# Altium project smoothieboard-alt.PrjPcb (part 3 of 4)

## Sheet smoothieboard-alt-p4.SchDoc: =ProjectTitle
size B; Author: JHEDLUND; Organization: Altium Limited; Address1: L3, 12a Rodborough Rd; Address2: Frenchs Forest; Address3: NSW; Address4: Australia 2086; DocumentNumber: 5; SheetNumber: 5; SheetTotal: 6
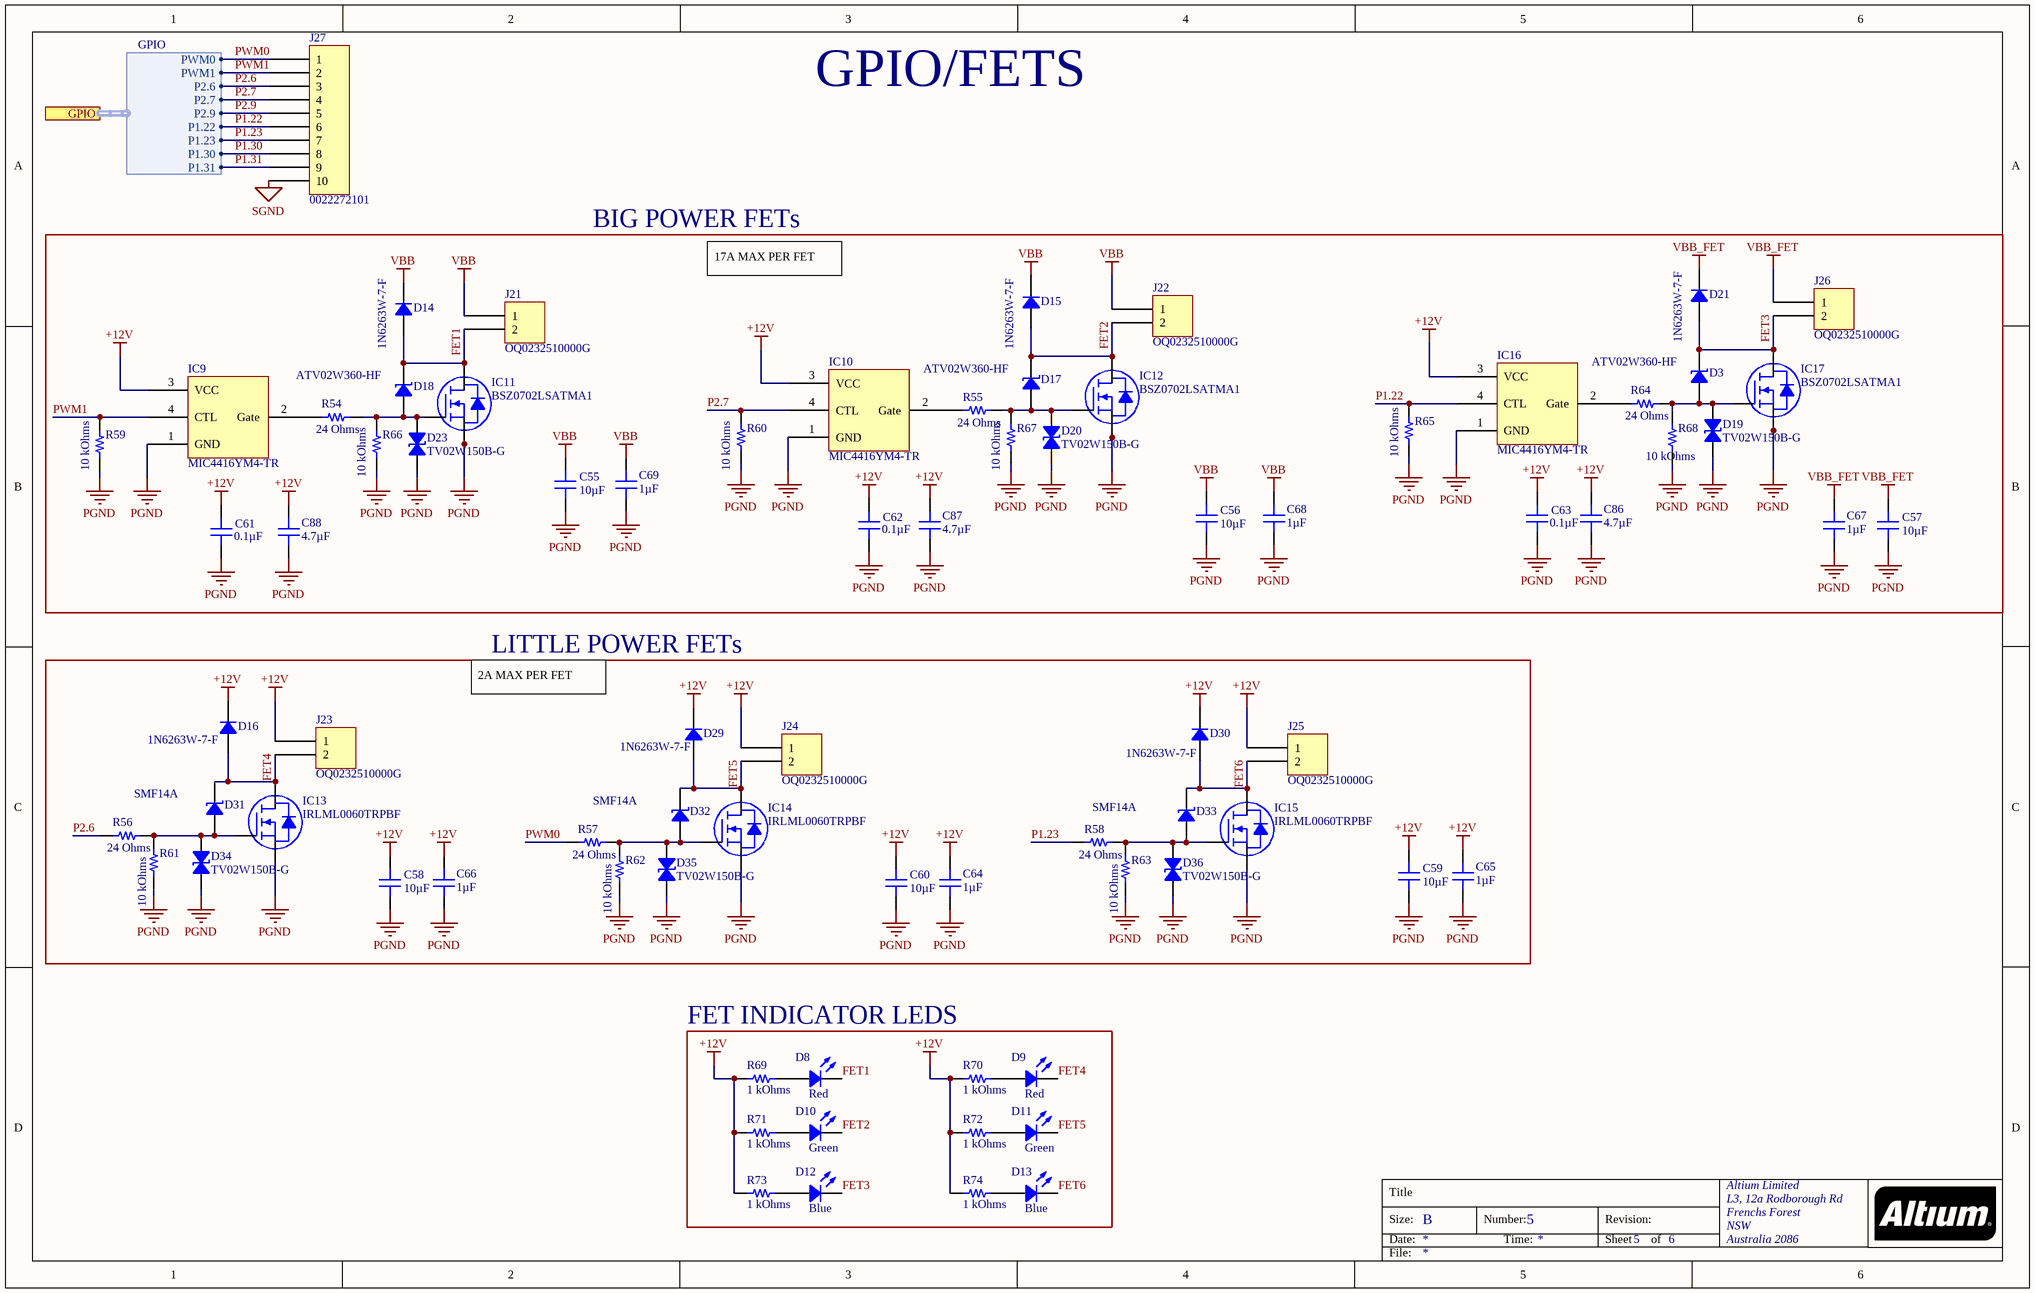
[diagram p3: smoothieboard-alt-p4.SchDoc]

### Parts
C55  10µF  [CAP 0603_1608]
C56  10µF  [CAP 0603_1608]
C57  10µF  [CAP 0603_1608]
C58  10µF  [CAP 0603_1608]
C59  10µF  [CAP 0603_1608]
C60  10µF  [CAP 0603_1608]
C61  0.1µF  [CAP 0603_1608]
C62  0.1µF  [CAP 0603_1608]
C63  0.1µF  [CAP 0603_1608]
C64  1µF  [CAP 0805_2012]
C65  1µF  [CAP 0805_2012]
C66  1µF  [CAP 0805_2012]
C67  1µF  [CAP 0805_2012]
C68  1µF  [CAP 0805_2012]
C69  1µF  [CAP 0805_2012]
C86  4.7µF  [CAP 0603_1608]
C87  4.7µF  [CAP 0603_1608]
C88  4.7µF  [CAP 0603_1608]
D3  ATV02W360-HF  [SOD123F]
D8  Red  [LED 0805_2012 RED]
D9  Red  [LED 0805_2012 RED]
D10  Green  [LED 0805_2012 GREEN]
D11  Green  [LED 0805_2012 GREEN]
D12  Blue  [LED 0805_2012 BLUE]
D13  Blue  [LED 0805_2012 BLUE]
D14  1N6263W-7-F  [SOD-123]
D15  1N6263W-7-F  [SOD-123]
D16  1N6263W-7-F  [SOD-123]
D17  ATV02W360-HF  [SOD123F]
D18  ATV02W360-HF  [SOD123F]
D19  TV02W150B-G  [SOD-123]
D20  TV02W150B-G  [SOD-123]
D21  1N6263W-7-F  [SOD-123]
D23  TV02W150B-G  [SOD-123]
D29  1N6263W-7-F  [SOD-123]
D30  1N6263W-7-F  [SOD-123]
D31  SMF14A  [SOD123F]
D32  SMF14A  [SOD123F]
D33  SMF14A  [SOD123F]
D34  TV02W150B-G  [SOD-123]
D35  TV02W150B-G  [SOD-123]
D36  TV02W150B-G  [SOD-123]
IC9  MIC4416YM4-TR  [MICROCHIP SOT-143-4]
IC10  MIC4416YM4-TR  [MICROCHIP SOT-143-4]
IC11  BSZ0702LSATMA1  [INFINEON PG-TSDSON-8]
IC12  BSZ0702LSATMA1  [INFINEON PG-TSDSON-8]
IC13  IRLML0060TRPBF  [INFINEON SOT-23-3]
IC14  IRLML0060TRPBF  [INFINEON SOT-23-3]
IC15  IRLML0060TRPBF  [INFINEON SOT-23-3]
IC16  MIC4416YM4-TR  [MICROCHIP SOT-143-4]
IC17  BSZ0702LSATMA1  [INFINEON PG-TSDSON-8]
J21  OQ0232510000G  [FCI 06-381-2PIN]
J22  OQ0232510000G  [FCI 06-381-2PIN]
J23  OQ0232510000G  [FCI 06-381-2PIN]
J24  OQ0232510000G  [FCI 06-381-2PIN]
J25  OQ0232510000G  [FCI 06-381-2PIN]
J26  OQ0232510000G  [FCI 06-381-2PIN]
J27  0022272101  [MOLEX KK 0022272101]
R54  24 Ohms  [RES 0402_1005]
R55  24 Ohms  [RES 0402_1005]
R56  24 Ohms  [RES 0402_1005]
R57  24 Ohms  [RES 0402_1005]
R58  24 Ohms  [RES 0402_1005]
R59  10 kOhms  [RES 0402_1005]
R60  10 kOhms  [RES 0402_1005]
R61  10 kOhms  [RES 0402_1005]
R62  10 kOhms  [RES 0402_1005]
R63  10 kOhms  [RES 0402_1005]
R64  24 Ohms  [RES 0402_1005]
R65  10 kOhms  [RES 0402_1005]
R66  10 kOhms  [RES 0402_1005]
R67  10 kOhms  [RES 0402_1005]
R68  10 kOhms  [RES 0402_1005]
R69  1 kOhms  [RES 0402_1005]
R70  1 kOhms  [RES 0402_1005]
R71  1 kOhms  [RES 0402_1005]
R72  1 kOhms  [RES 0402_1005]
R73  1 kOhms  [RES 0402_1005]
R74  1 kOhms  [RES 0402_1005]

### Blocks framed on the sheet
BIG POWER FETs: C55-C57 C61-C63 C67-C69 C86-C88 D3 D14 D15 D17-D21 D23 IC9-IC12 IC16 IC17 J21 J22 J26 R54 R55 R59 R60 R64-R68
LITTLE POWER FETs: C58-C60 C64-C66 D16 D29-D36 IC13-IC15 J23-J25 R56-R58 R61-R63
FET INDICATOR LEDS: D8-D13 R69-R74

### Ports
GPIO (harness GPIO)

### Harnesses
GPIO: PWM0, PWM1, P2.6, P2.7, P2.9, P1.22, P1.23, P1.30, P1.31

### Nets
+12V: C58.2 C59.2 C60.2 C61.2 C62.2 C63.2 C64.2 C65.2 C66.2 C86.2 C87.2 C88.2 D16.2 D29.2 D30.2 IC9.3(VCC) IC10.3(VCC) IC16.3(VCC) J23.1 J24.1 J25.1 R69.1 R70.1 R71.1 R72.1 R73.1 R74.1
PGND: C55.1 C56.1 C57.1 C58.1 C59.1 C60.1 C61.1 C62.1 C63.1 C64.1 C65.1 C66.1 C67.1 C68.1 C69.1 C86.1 C87.1 C88.1 D19.1 D20.1 D23.1 D34.1 D35.1 D36.1 IC9.1(GND) IC10.1(GND) IC11.1(S) IC11.2(S) IC11.3(S) IC12.1(S) IC12.2(S) IC12.3(S) IC13.2(S) IC14.2(S) IC15.2(S) IC16.1(GND) IC17.1(S) IC17.2(S) IC17.3(S) R59.1 R60.1 R61.1 R62.1 R63.1 R65.1 R66.1 R67.1 R68.1
SGND: J27.10
VBB: C55.2 C56.2 C68.2 C69.2 D14.2 D15.2 J21.1 J22.1
VBB_FET: C57.2 C67.2 D21.2 J26.1
FET1: D8.2 D14.1 D18.2 IC11.5(D) IC11.6(D) IC11.7(D) IC11.8(D) J21.2
FET2: D10.2 D15.1 D17.2 IC12.5(D) IC12.6(D) IC12.7(D) IC12.8(D) J22.2
FET3: D3.2 D12.2 D21.1 IC17.5(D) IC17.6(D) IC17.7(D) IC17.8(D) J26.2
FET4: D9.2 D16.1 D31.2 IC13.3(D) J23.2
FET5: D11.2 D29.1 D32.2 IC14.3(D) J24.2
FET6: D13.2 D30.1 D33.2 IC15.3(D) J25.2
P1.22: IC16.4(CTL) J27.6 R65.2 ; port GPIO.P1.22
P1.23: J27.7 R58.1 ; port GPIO.P1.23
P1.30: J27.8 ; port GPIO.P1.30
P1.31: J27.9 ; port GPIO.P1.31
P2.6: J27.3 R56.1 ; port GPIO.P2.6
P2.7: IC10.4(CTL) J27.4 R60.2 ; port GPIO.P2.7
P2.9: J27.5 ; port GPIO.P2.9
PWM0: J27.1 R57.1 ; port GPIO.PWM0
PWM1: IC9.4(CTL) J27.2 R59.2 ; port GPIO.PWM1
NetD3_1: D3.1 D19.2 IC17.4(G) R64.2 R68.2
NetD8_1: D8.1 R69.2
NetD9_1: D9.1 R70.2
NetD10_1: D10.1 R71.2
NetD11_1: D11.1 R72.2
NetD12_1: D12.1 R73.2
NetD13_1: D13.1 R74.2
NetD17_1: D17.1 D20.2 IC12.4(G) R55.2 R67.2
NetD18_1: D18.1 D23.2 IC11.4(G) R54.2 R66.2
NetD31_1: D31.1 D34.2 IC13.1(G) R56.2 R61.2
NetD32_1: D32.1 D35.2 IC14.1(G) R57.2 R62.2
NetD33_1: D33.1 D36.2 IC15.1(G) R58.2 R63.2
NetIC9_2: IC9.2(Gate) R54.1
NetIC10_2: IC10.2(Gate) R55.1
NetIC16_2: IC16.2(Gate) R64.1

### Notes on the sheet
- GPIO/FETS
- 17A MAX PER FET
- 2A MAX PER FET
- Title
- Size:
- Date:
- B
- Number:
- Time:
- Revision:
- Sheet
- of
- File:

### Library data of the parts
C55-C60 = GRM188R60J106KE47D: CAP CER 10UF 6.3V X5R 0603; Manufacturer: Murata Electronics; Tolerance: ±10%; Part Number: GRM188R60J106KE47D; Value: 10µF; Applications: General Purpose; Capacitance: 10µF; ComponentLink1Description: Datasheet; ComponentLink1URL: https://search.murata.co.jp/Ceramy/image/img/A01X/G101/ENG/GRM188R60J106KE47-02.pdf; ComponentLink2Description: DigiKey Link; ComponentLink2URL: http://digikey.com/product-detail/en/murata-electronics/GRM188R60J106KE47D/490-12538-1-ND/5797528; Device Package: 0603 (1608 Metric); LastUpdated: 9/2/2020 01:03:11; Lifecycle Status: Active; Minimum Order: 1; Mounting Type: Surface Mount, MLCC; Operating Temperature: -55°C ~ 85°C; Package / Case: 0603 (1608 Metric); Packaging: TapeAndReel; PartId: 14982; Part Status: Active; Price: 0.03; Series: GRM; Size / Dimension: 0.063" L x 0.031" W (1.60mm x 0.80mm); Supplier 1: DigiKey; Supplier Part Number 1: 490-12538-1-ND; Temperature Coefficient: X5R; Thickness (Max): 0.035" (0.90mm); Voltage - Rated: 6.3V
C61-C63 = CML0603X7R104KT50V: CAP CER 0.1UF 50V X7R 0603; Manufacturer: Stackpole Electronics Inc; Tolerance: ±10%; Part Number: CML0603X7R104KT50V; Value: 0.1µF; Applications: General Purpose; Capacitance: 0.1µF; ComponentLink1Description: Datasheet; ComponentLink1URL: http://www.seielect.com/Catalog/SEI-CML.PDF; ComponentLink2Description: DigiKey Link; ComponentLink2URL: http://digikey.com/product-detail/en/stackpole-electronics-inc/CML0603X7R104KT50V/738-CML0603X7R104KT50VCT-ND/10660220; Device Package: 0603 (1608 Metric); LastUpdated: 9/2/2020 01:03:28; Lifecycle Status: Active; Minimum Order: 1; Mounting Type: Surface Mount, MLCC; Operating Temperature: -55°C ~ 125°C; Package / Case: 0603 (1608 Metric); Packaging: Unknown; PartId: 26324; Part Status: Active; Price: 0.01; Series: CML_X7R; Supplier 1: DigiKey; Supplier Part Number 1: 738-CML0603X7R104KT50VCT-ND; Temperature Coefficient: X7R; Voltage - Rated: 50V
C64-C69 = 08051C105K4Z2A: CAP CER 1UF 100V X7R 0805; Manufacturer: AVX Corporation; Tolerance: ±10%; Part Number: 08051C105K4Z2A; Value: 1µF; Applications: Automotive, Boardflex Sensitive; Capacitance: 1µF; ComponentLink1Description: Datasheet; ComponentLink1URL: http://datasheets.avx.com/AutoMLCC.pdf; ComponentLink2Description: DigiKey Link; ComponentLink2URL: http://digikey.com/product-detail/en/avx-corporation/08051C105K4Z2A/478-12143-1-ND/9374712; Device Package: 0805 (2012 Metric); Features: Soft Termination; LastUpdated: 9/2/2020 01:04:22; Lifecycle Status: Active; Minimum Order: 1; Mounting Type: Surface Mount, MLCC; Operating Temperature: -55°C ~ 125°C; Package / Case: 0805 (2012 Metric); Packaging: TapeAndReel; PartId: 13513; Part Status: Active; Price: 0.10; Ratings: AEC-Q200; Series: FLEXITERM®; Size / Dimension: 0.079" L x 0.049" W (2.01mm x 1.25mm); Supplier 1: DigiKey; Supplier Part Number 1: 478-12143-1-ND; Temperature Coefficient: X7R; Voltage - Rated: 100V
C86-C88 = C1608X5R1C475K080AE: CAP CER 4.7UF 16V X5R 0603; Manufacturer: TDK Corporation; Tolerance: ±10%; Part Number: C1608X5R1C475K080AE; Value: 4.7µF; Applications: Boardflex Sensitive; Capacitance: 4.7µF; ComponentLink1Description: Datasheet; ComponentLink1URL: https://product.tdk.com/info/en/catalog/datasheets/mlcc_commercial_soft_en.pdf?ref_disty=digikey; ComponentLink2Description: DigiKey Link; ComponentLink2URL: http://digikey.com/product-detail/en/tdk-corporation/C1608X5R1C475K080AE/445-175225-1-ND/7907789; Device Package: 0603 (1608 Metric); Features: Soft Termination; LastUpdated: 9/2/2020 01:03:07; Lifecycle Status: Active; Minimum Order: 1; Mounting Type: Surface Mount, MLCC; Operating Temperature: -55°C ~ 85°C; Package / Case: 0603 (1608 Metric); Packaging: TapeAndReel; PartId: 16130; Part Status: Active; Price: 0.06; Series: C; Size / Dimension: 0.063" L x 0.031" W (1.60mm x 0.80mm); Supplier 1: DigiKey; Supplier Part Number 1: 445-175225-1-ND; Temperature Coefficient: X5R; Thickness (Max): 0.039" (1.00mm); Voltage - Rated: 16V
D3 D17 D18 = ATV02W360-HF: TVS DIODE 36V 58.1V SOD123; Manufacturer: Comchip Technology; Current - Peak Pulse (10/1000µs): 3.44A; Power Line Protection: No; Power - Peak Pulse: 200W; Type: Zener; Unidirectional Channels: 1; Voltage - Breakdown (Min): 40V; Part Number: ATV02W360-HF; Applications: Automotive; ComponentLink1Description: Datasheet; ComponentLink1URL: http://www.comchiptech.com/admin/files/product/ATV02W-HF%20series%20RevC.pdf; ComponentLink2Description: DigiKey Link; ComponentLink2URL: http://digikey.com/product-detail/en/comchip-technology/ATV02W360-HF/641-1665-1-ND/5013870; LastUpdated: 9/2/2020 01:28:36; Lifecycle Status: Active; Minimum Order: 1; Mounting Type: Surface Mount; Operating Temperature: -55°C ~ 150°C (TJ); Package / Case: SOD-123F; Packaging: TapeAndReel; PartId: 10119; Part Status: Active; Price: 0.11; Series: Automotive, AEC-Q101; Supplier 1: DigiKey; Supplier Part Number 1: 641-1665-1-ND; Supplier Device Package: SOD-123; Voltage - Clamping (Max) @ Ipp: 58.1V; Voltage - Reverse Standoff (Typ): 36V
D8 D9 = LTST-C171KRKT: LED RED CLEAR SMD; Manufacturer: Lite-On Inc.; Configuration: Standard; Current - Test: 20mA; Lens Color: Colorless; Lens Size: 1.40mm x 1.25mm; Lens Style: Rectangle with Flat Top; Millicandela Rating: 54mcd; Viewing Angle: 130°; Voltage - Forward (Vf) (Typ): 2V; Wavelength - Dominant: 631nm; Wavelength - Peak: 639nm; Part Number: LTST-C171KRKT; Color: Red; ComponentLink1Description: Datasheet; ComponentLink1URL: http://optoelectronics.liteon.com/upload/download/DS22-2000-109/LTST-C171KRKT.pdf; ComponentLink2Description: DigiKey Link; ComponentLink2URL: http://digikey.com/product-detail/en/lite-on-inc/LTST-C171KRKT/160-1427-1-ND/386800; Device Package: 0805 (2012 Metric); Height (Max): 0.90mm; LastUpdated: 9/2/2020 01:21:01; Lens Transparency: Clear; Lifecycle Status: Active; Minimum Order: 1; Mounting Type: Surface Mount; Package / Case: 0805 (2012 Metric); Packaging: TapeAndReel; PartId: 347; Part Status: Active; Price: 0.05; Series: -; Size / Dimension: 2.00mm L x 1.25mm W; Supplier 1: DigiKey; Supplier Part Number 1: 160-1427-1-ND; Value: Red
D10 D11 = LTST-C171KGKT: LED GREEN CLEAR SMD; Manufacturer: Lite-On Inc.; Configuration: Standard; Current - Test: 20mA; Lens Color: Colorless; Lens Size: 1.40mm x 1.25mm; Lens Style: Rectangle with Flat Top; Millicandela Rating: 35mcd; Viewing Angle: 130°; Voltage - Forward (Vf) (Typ): 2V; Wavelength - Dominant: 571nm; Wavelength - Peak: 574nm; Part Number: LTST-C171KGKT; Color: Green; ComponentLink1Description: Datasheet; ComponentLink1URL: http://optoelectronics.liteon.com/upload/download/DS22-2000-118/LTST-C171KGKT.pdf; ComponentLink2Description: DigiKey Link; ComponentLink2URL: http://digikey.com/product-detail/en/lite-on-inc/LTST-C171KGKT/160-1426-1-ND/386798; Device Package: 0805 (2012 Metric); Height (Max): 0.90mm; LastUpdated: 9/2/2020 01:21:04; Lens Transparency: Clear; Lifecycle Status: Active; Minimum Order: 1; Mounting Type: Surface Mount; Package / Case: 0805 (2012 Metric); Packaging: TapeAndReel; PartId: 281; Part Status: Active; Price: 0.05; Series: -; Size / Dimension: 2.00mm L x 1.25mm W; Supplier 1: DigiKey; Supplier Part Number 1: 160-1426-1-ND; Value: Green
D12 D13 = LTST-C170TBKT: LED BLUE CLEAR SMD; Manufacturer: Lite-On Inc.; Configuration: Standard; Current - Test: 20mA; Lens Color: Colorless; Lens Size: 1.40mm x 1.25mm; Lens Style: Rectangle with Flat Top; Millicandela Rating: 104mcd; Viewing Angle: 130°; Voltage - Forward (Vf) (Typ): 3.3V; Wavelength - Dominant: 470nm; Wavelength - Peak: 468nm; Part Number: LTST-C170TBKT; Color: Blue; ComponentLink1Description: Datasheet; ComponentLink1URL: http://optoelectronics.liteon.com/upload/download/DS-22-99-0226/LTST-C170TBKT.pdf; ComponentLink2Description: DigiKey Link; ComponentLink2URL: http://digikey.com/product-detail/en/lite-on-inc/LTST-C170TBKT/160-1579-1-ND/564889; Device Package: 0805 (2012 Metric); Height (Max): 1.10mm; LastUpdated: 9/2/2020 01:20:30; Lens Transparency: Clear; Lifecycle Status: Active; Minimum Order: 1; Mounting Type: Surface Mount; Package / Case: 0805 (2012 Metric); Packaging: TapeAndReel; PartId: 776; Part Status: Active; Price: 0.08; Series: -; Size / Dimension: 2.00mm L x 1.25mm W; Supplier 1: DigiKey; Supplier Part Number 1: 160-1579-1-ND; Value: Blue
D14-D16 D21 D29 D30 = 1N6263W-7-F: DIODE SCHOTTKY 60V 15MA SOD123; Manufacturer: Diodes Incorporated; Current - Average Rectified (Io): 15mA (DC); Current - Reverse Leakage @ Vr: 200nA @ 50V; Reverse Recovery Time (trr): 1ns; Speed: Small Signal =< 200mA (Io), Any Speed; Voltage - Forward (Vf) (Max) @ If: 1V @ 15mA; Part Number: 1N6263W-7-F; ComponentLink1Description: Datasheet; ComponentLink1URL: https://www.diodes.com/assets/Datasheets/ds11014.pdf; ComponentLink2Description: DigiKey Link; ComponentLink2URL: http://digikey.com/product-detail/en/diodes-incorporated/1N6263W-7-F/1N6263W-FDICT-ND/815284; Diode Type: Schottky; LastUpdated: 9/2/2020 01:19:07; Lifecycle Status: Active; Minimum Order: 1; Mounting Type: Surface Mount; Operating Temperature - Junction: -55°C ~ 125°C; Package / Case: SOD-123; Packaging: TapeAndReel; PartId: 2234; Part Status: Active; Price: 0.09; Series: -; Supplier 1: DigiKey; Supplier Part Number 1: 1N6263W-FDICT-ND; Supplier Device Package: SOD-123; Voltage - DC Reverse (Vr) (Max): 60V
D19 D20 D23 D34-D36 = TV02W150B-G: TVS DIODE 15V 24.4V SOD123; Manufacturer: Comchip Technology; Bidirectional Channels: 1; Current - Peak Pulse (10/1000µs): 8.2A; Power Line Protection: No; Power - Peak Pulse: 200W; Type: Zener; Voltage - Breakdown (Min): 16.7V; Part Number: TV02W150B-G; Applications: General Purpose; ComponentLink1Description: Datasheet; ComponentLink1URL: http://www.comchiptech.com/admin/files/product/TV02W-G series RevE.pdf; ComponentLink2Description: DigiKey Link; ComponentLink2URL: http://digikey.com/product-detail/en/comchip-technology/TV02W150B-G/641-2066-1-ND/10131652; LastUpdated: 9/2/2020 01:28:33; Lifecycle Status: Active; Minimum Order: 1; Mounting Type: Surface Mount; Operating Temperature: -55°C ~ 150°C (TJ); Package / Case: SOD-123; Packaging: TapeAndReel; PartId: 10024; Part Status: Active; Price: 0.11; Series: -; Supplier 1: DigiKey; Supplier Part Number 1: 641-2066-1-ND; Supplier Device Package: SOD-123; Voltage - Clamping (Max) @ Ipp: 24.4V; Voltage - Reverse Standoff (Typ): 15V
D31-D33 = SMF14A: TVS DIODE 14V 23.2V SOD123F; Manufacturer: Littelfuse Inc.; Current - Peak Pulse (10/1000µs): 8.6A; Power Line Protection: No; Power - Peak Pulse: 200W; Type: Zener; Unidirectional Channels: 1; Voltage - Breakdown (Min): 15.6V; Part Number: SMF14A; Applications: General Purpose; ComponentLink1Description: Datasheet; ComponentLink1URL: https://www.littelfuse.com/~/media/electronics/datasheets/tvs_diodes/littelfuse_tvs_diode_smf_datasheet.pdf.pdf; ComponentLink2Description: DigiKey Link; ComponentLink2URL: http://digikey.com/product-detail/en/littelfuse-inc/SMF14A/F5816CT-ND/3672306; LastUpdated: 9/2/2020 01:28:36; Lifecycle Status: Active; Minimum Order: 1; Mounting Type: Surface Mount; Operating Temperature: -55°C ~ 150°C (TJ); Package / Case: SOD-123F; Packaging: TapeAndReel; PartId: 10135; Part Status: Active; Price: 0.11; Series: SMF; Supplier 1: DigiKey; Supplier Part Number 1: F5816CT-ND; Supplier Device Package: SOD-123F; Voltage - Clamping (Max) @ Ipp: 23.2V; Voltage - Reverse Standoff (Typ): 14V
IC9 IC10 IC16 = MIC4416YM4-TR: IC GATE DRVR LOW-SIDE SOT143; Manufacturer: Microchip Technology; Channel Type: Single; Current - Peak Output (Source, Sink): 1.2A, 1.2A; Gate Type: N-Channel MOSFET; Input Type: Non-Inverting; Logic Voltage - VIL, VIH: 0.8V, 2.4V; Number of Drivers: 1; Rise / Fall Time (Typ): 14ns, 16ns; Voltage - Supply: 4.5V ~ 18V; Part Number: MIC4416YM4-TR; ComponentLink1Description: Datasheet; ComponentLink1URL: http://www.microchip.com/mymicrochip/filehandler.aspx?ddocname=en579163; ComponentLink2Description: DigiKey Link; ComponentLink2URL: http://digikey.com/product-detail/en/microchip-technology/MIC4416YM4-TR/576-1187-1-ND/771864; Device Package: TO-253-4, TO-253AA; Driven Configuration: Low-Side; LastUpdated: 1/31/2020 01:32:45; Lifecycle Status: Active; Minimum Order: 1; Mounting Type: Surface Mount; Operating Temperature: -40°C ~ 150°C (TJ); Package / Case: TO-253-4, TO-253AA; Packaging: TapeAndReel; PartId: 7; Part Status: Active; Price: 0.68; Series: IttyBitty®; Supplier 1: DigiKey; Supplier Part Number 1: 576-1187-1-ND; Supplier Device Package: SOT-143
IC11 IC12 IC17 = BSZ0702LSATMA1: TRENCH 40<-<100V; Manufacturer: Infineon Technologies; Current - Continuous Drain (Id) @ 25°C: 17A (Ta), 40A (Tc); Drain to Source Voltage (Vdss): 60V; Drive Voltage (Max Rds On,  Min Rds On): 4.5V, 10V; FET Type: N-Channel; Gate Charge (Qg) (Max) @ Vgs: 22nC @ 4.5V; Input Capacitance (Ciss) (Max) @ Vds: 3100pF @ 30V; Power Dissipation (Max): 2.1W (Ta), 69W (Tc); Rds On (Max) @ Id, Vgs: 4mOhm @ 20A, 10V; Vgs (Max): ±20V; Vgs(th) (Max) @ Id: 2.3V @ 36µA; Part Number: BSZ0702LSATMA1; ComponentLink1Description: Datasheet; ComponentLink1URL: https://www.infineon.com/dgdl/Infineon-BSZ0702LS-DataSheet-v02_01-EN.pdf?fileId=5546d462700c0ae601708b86789613d0; ComponentLink2Description: DigiKey Link; ComponentLink2URL: http://digikey.com/product-detail/en/infineon-technologies/BSZ0702LSATMA1/448-BSZ0702LSATMA1CT-ND/12756161; LastUpdated: 8/30/2020 21:06:51; Lifecycle Status: Active; Minimum Order: 1; Mounting Type: Surface Mount; Package / Case: 8-PowerTDFN; Packaging: TapeAndReel; Price: 0.45; Series: OptiMOS™; Supplier 1: DigiKey; Supplier Part Number 1: 448-BSZ0702LSATMA1CT-ND; Supplier Device Package: PG-TSDSON-8-FL; Technology: MOSFET (Metal Oxide); Device Package: 8-PowerTDFN
IC13-IC15 = IRLML0060TRPBF: MOSFET N-CH 60V 2.7A SOT-23-3; Manufacturer: Infineon Technologies; Current - Continuous Drain (Id) @ 25°C: 2.7A (Ta); Drive Voltage (Max Rds On,  Min Rds On): 4.5V, 10V; FET Type: N-Channel; Gate Charge (Qg) (Max) @ Vgs: 2.5nC @ 4.5V; Input Capacitance (Ciss) (Max) @ Vds: 290pF @ 25V; Power Dissipation (Max): 1.25W (Ta); Rds On (Max) @ Id, Vgs: 92mOhm @ 2.7A, 10V; Vgs (Max): ±16V; Vgs(th) (Max) @ Id: 2.5V @ 25µA; Part Number: IRLML0060TRPBF; ComponentLink1Description: Datasheet; ComponentLink1URL: https://www.infineon.com/dgdl/irlml0060pbf.pdf?fileId=5546d462533600a40153566493ef25e6; ComponentLink2Description: DigiKey Link; ComponentLink2URL: http://digikey.com/product-detail/en/infineon-technologies/IRLML0060TRPBF/IRLML0060TRPBFCT-ND/2202229; Drain to Source Voltage (Vdss): 60V; LastUpdated: 9/2/2020 01:25:05; Lifecycle Status: Active; Minimum Order: 1; Mounting Type: Surface Mount; Operating Temperature: -55°C ~ 150°C (TJ); Package / Case: TO-236-3, SC-59, SOT-23-3; Packaging: TapeAndReel; Part Status: Active; Price: 0.13; Series: HEXFET®; Supplier 1: DigiKey; Supplier Part Number 1: IRLML0060TRPBFCT-ND; Supplier Device Package: Micro3™/SOT-23; Technology: MOSFET (Metal Oxide)
J21-J26 = OQ0232510000G: TERM BLOCK HDR 2POS 90DEG 3.81MM; Manufacturer: Amphenol Anytek; Current - UL: 10A; Header Orientation: 90°, Right Angle; Number of Levels: 1; Number of Positions: 2; Pitch: 0.150" (3.81mm); Voltage - UL: 300V; Part Number: OQ0232510000G; Color: Green; ComponentLink1Description: Datasheet; ComponentLink1URL: http://portal.fciconnect.com/Comergent//fci/drawing/oqxx32x100j0g.pdf; ComponentLink2Description: DigiKey Link; ComponentLink2URL: //digikey.com/product-detail/en/amphenol-anytek/OQ0232510000G/609-3819-ND/2261255; Contact Mating Finish: Tin; LastUpdated: 12/16/2019 19:14:30; Lifecycle Status: 0; Minimum Order: 1; Mounting Type: Through Hole; Operating Temperature: -40°C ~ 115°C; Packaging: Bulk; Part Status: Active; Positions Per Level: 2; Price: 0.49; Series: 06-381; Supplier 1: DigiKey; Supplier Part Number 1: 609-3819-ND; Termination Style: Solder; Type: Header, Male Pins, Shrouded (4 Side)
J27 = 0022272101: CONN HEADER VERT 10POS 2.54MM; Manufacturer: Molex; Contact Length - Mating: 0.295" (7.49mm); Contact Length - Post: 0.140" (3.56mm); Material Flammability Rating: UL94 V-0; Number of Positions: 10; Number of Positions Loaded: All; Overall Contact Length: 0.560" (14.22mm); Pitch - Mating: 0.100" (2.54mm); Shrouding: Shrouded - 1 Wall; Style: Board to Cable/Wire; Part Number: 0022272101; ComponentLink1Description: Datasheet; ComponentLink1URL: https://www.molex.com/pdm_docs/sd/022272101_sd.pdf; ComponentLink2Description: DigiKey Link; ComponentLink2URL: http://digikey.com/product-detail/en/molex/0022272101/WM4119-ND/1130585; Connector Type: Header; Contact Finish - Mating: Tin; Contact Finish - Post: Tin; Contact Finish Thickness - Mating: 100.0µin (2.54µm); Contact Material: Brass; Contact Shape: Square; Contact Type: Male Pin; Fastening Type: Friction Lock; Insulation Color: Natural; Insulation Height: 0.461" (11.70mm); Insulation Material: Polyamide (PA), Nylon; LastUpdated: 1/12/2020 23:53:02; Lifecycle Status: Active; Minimum Order: 1; Mounting Type: Through Hole; Number of Rows: 1; Packaging: Bulk; PartId: 84; Part Status: Active; Price: 0.73; Series: KK 6410; Supplier 1: DigiKey; Supplier Part Number 1: WM4119-ND; Termination: Solder
R54-R58 R64 = ERJ-PA2F24R0X: RES SMD 24 OHM 1% 1/5W 0402; Manufacturer: Panasonic Electronic Components; Power (Watts): 0.2W, 1/5W; Temperature Coefficient: ±100ppm/°C; Part Number: ERJ-PA2F24R0X; Value: 24 Ohms; ComponentLink1Description: Datasheet; ComponentLink1URL: https://industrial.panasonic.com/cdbs/www-data/pdf/RDO0000/AOA0000C331.pdf; ComponentLink2Description: DigiKey Link; ComponentLink2URL: http://digikey.com/product-detail/en/panasonic-electronic-components/ERJ-PA2F24R0X/P124461CT-ND/10271437; Composition: Thick Film; Device Package: 0402 (1005 Metric); Features: Automotive AEC-Q200, Pulse Withstanding; Height - Seated (Max): 0.016" (0.40mm); LastUpdated: 9/2/2020 01:07:52; Lifecycle Status: Active; Minimum Order: 1; Number of Terminations: 2; Operating Temperature: -55°C ~ 155°C; Package / Case: 0402 (1005 Metric); Packaging: TapeAndReel; PartId: 11226; Part Status: Active; Price: 0.02; Ratings: AEC-Q200; Resistance: 24 Ohms; Series: ERJ; Size / Dimension: 0.039" L x 0.022" W (1.00mm x 0.55mm); Supplier 1: DigiKey; Supplier Part Number 1: P124461CT-ND; Supplier Device Package: 0402; Tolerance: ±1%
R59-R63 R65-R68 = CRCW040210K0JNTD: RES SMD 10K OHM 5% 1/16W 0402; Manufacturer: Vishay Dale; Power (Watts): 0.063W, 1/16W; Temperature Coefficient: ±200ppm/°C; Part Number: CRCW040210K0JNTD; Value: 10 kOhms; ComponentLink1Description: Datasheet; ComponentLink1URL: http://www.vishay.com/docs/20008/dcrcw.pdf; ComponentLink2Description: DigiKey Link; ComponentLink2URL: http://digikey.com/product-detail/en/vishay-dale/CRCW040210K0JNTD/541-CRCW040210K0JNTDCT-ND/11501263; Composition: Thick Film; Device Package: 0402 (1005 Metric); Features: Automotive AEC-Q200; LastUpdated: 9/2/2020 01:07:22; Lifecycle Status: Active; Minimum Order: 1; Number of Terminations: 2; Operating Temperature: -55°C ~ 155°C; Package / Case: 0402 (1005 Metric); Packaging: TapeAndReel; PartId: 56880; Price: 0.01; Ratings: AEC-Q200; Resistance: 10 kOhms; Series: CRCW; Supplier 1: DigiKey; Supplier Part Number 1: 541-CRCW040210K0JNTDCT-ND; Supplier Device Package: 0402; Tolerance: ±5%
R69-R74 = CRCW04021K00FKEDHP: RES SMD 1K OHM 1% 1/5W 0402; Manufacturer: Vishay Dale; Power (Watts): 0.2W, 1/5W; Temperature Coefficient: ±100ppm/°C; Part Number: CRCW04021K00FKEDHP; Value: 1 kOhms; ComponentLink1Description: Datasheet; ComponentLink1URL: http://www.vishay.com/docs/20043/crcwhpe3.pdf; ComponentLink2Description: DigiKey Link; ComponentLink2URL: http://digikey.com/product-detail/en/vishay-dale/CRCW04021K00FKEDHP/541-1.00KYCT-ND/2223030; Composition: Thick Film; Device Package: 0402 (1005 Metric); Features: Automotive AEC-Q200, Pulse Withstanding; Height - Seated (Max): 0.016" (0.40mm); LastUpdated: 9/2/2020 01:08:02; Lifecycle Status: Active; Minimum Order: 1; Number of Terminations: 2; Operating Temperature: -55°C ~ 155°C; Package / Case: 0402 (1005 Metric); Packaging: TapeAndReel; PartId: 6224; Part Status: Active; Price: 0.01; Ratings: AEC-Q200; Resistance: 1 kOhms; Series: CRCW-HP; Size / Dimension: 0.039" L x 0.020" W (1.00mm x 0.50mm); Supplier 1: DigiKey; Supplier Part Number 1: 541-1.00KYCT-ND; Supplier Device Package: 0402; Tolerance: ±1%

## Sheet smoothieboard-alt-p5.SchDoc: =ProjectTitle
size B; Organization: Altium Limited; Address1: L3, 12a Rodborough Rd; Address2: Frenchs Forest; Address3: NSW; Address4: Australia 2086; DocumentNumber: 6; SheetNumber: 6; SheetTotal: 6
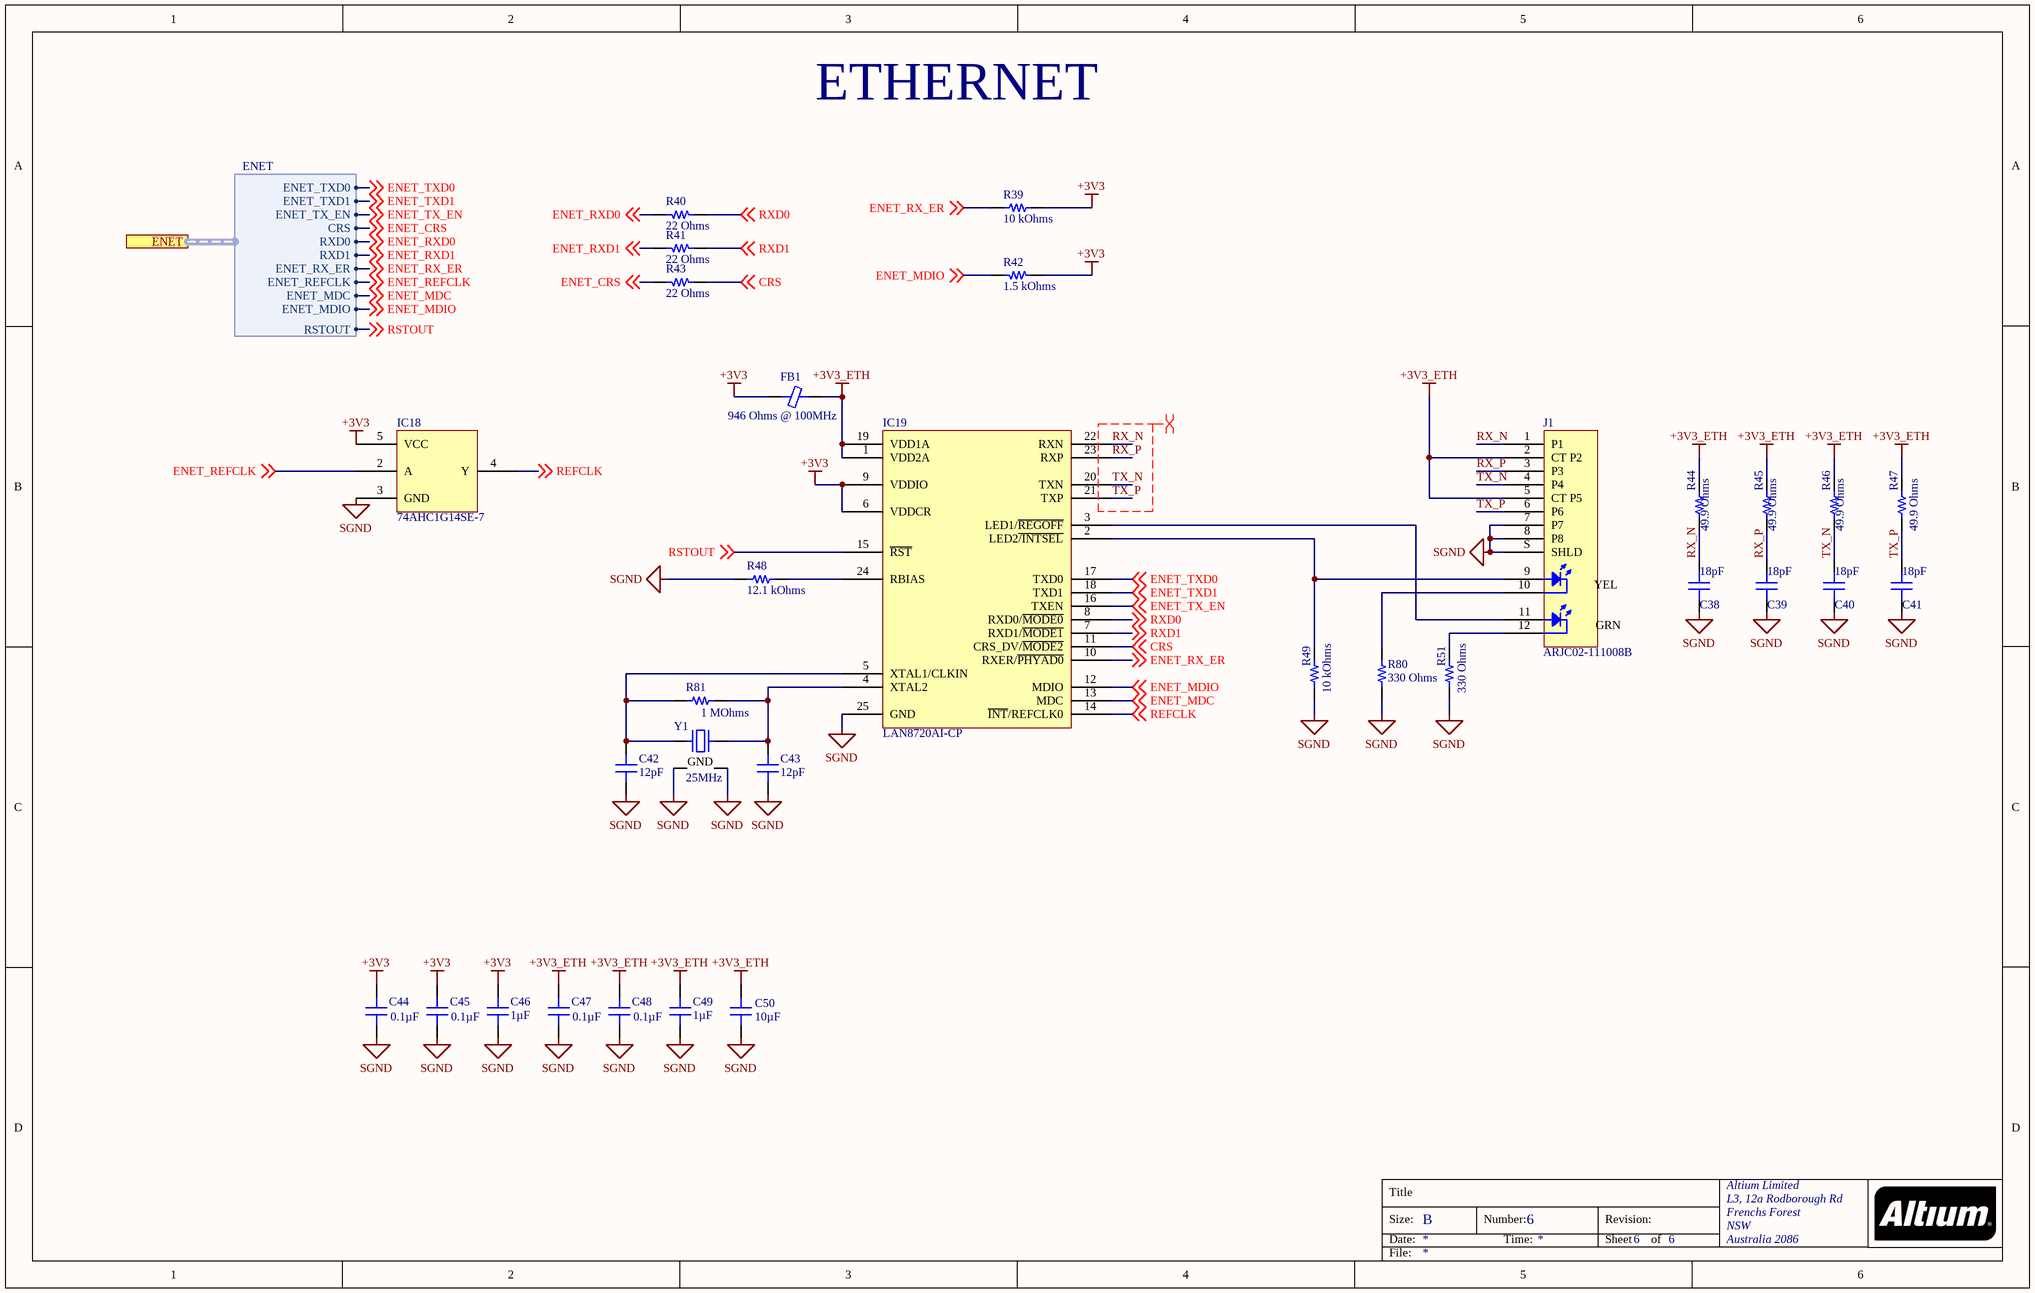
[diagram p4: smoothieboard-alt-p5.SchDoc]

### Parts
C38  18pF  [CAP 0402_1005]
C39  18pF  [CAP 0402_1005]
C40  18pF  [CAP 0402_1005]
C41  18pF  [CAP 0402_1005]
C42  12pF  [CAP 0402_1005]
C43  12pF  [CAP 0402_1005]
C44  0.1µF  [CAP 0402_1005]
C45  0.1µF  [CAP 0402_1005]
C46  1µF  [CAP 0603_1608]
C47  0.1µF  [CAP 0402_1005]
C48  0.1µF  [CAP 0402_1005]
C49  1µF  [CAP 0603_1608]
C50  10µF  [CAP 0603_1608]
FB1  946 Ohms @ 100MHz  [FER 1206_3216]
IC18  74AHC1G14SE-7  [DIODES INC - SOT353]
IC19  LAN8720AI-CP  [SMSC QFN-24 4X4MM]
J1  ARJC02-111008B  [ABRACON ARJC02-111008B]
R39  10 kOhms  [RES 0603_1608]
R40  22 Ohms  [RES 0603_1608]
R41  22 Ohms  [RES 0603_1608]
R42  1.5 kOhms  [RES 0402_1005]
R43  22 Ohms  [RES 0603_1608]
R44  49.9 Ohms  [RES 0402_1005]
R45  49.9 Ohms  [RES 0402_1005]
R46  49.9 Ohms  [RES 0402_1005]
R47  49.9 Ohms  [RES 0402_1005]
R48  12.1 kOhms  [RES 0402_1005]
R49  10 kOhms  [RES 0603_1608]
R51  330 Ohms  [RES 0603_1608]
R80  330 Ohms  [RES 0603_1608]
R81  1 MOhms  [RES 0402_1005]
Y1  25MHz  [KYOCERA CX2016DB]

### Ports
ENET (harness ENET)

### Harnesses
ENET: CRS, RXD0, RXD1, ENET_TXD0, ENET_TXD1, ENET_TX_EN, ENET_RX_ER, ENET_REFCLK, ENET_MDC, ENET_MDIO, RSTOUT

### Nets
+3V3: C44.2 C45.2 C46.2 FB1.1 IC18.5(VCC) IC19.6(VDDCR) IC19.9(VDDIO) R39.2 R42.1
+3V3_ETH: C47.2 C48.2 C49.2 C50.2 FB1.2 IC19.1(VDD2A) IC19.19(VDD1A) J1.2(CT_P2) J1.5(CT_P5) R44.2 R45.2 R46.2 R47.2
SGND: C38.1 C39.1 C40.1 C41.1 C42.2 C43.2 C44.1 C45.1 C46.1 C47.1 C48.1 C49.1 C50.1 IC18.3(GND) IC19.25(GND) J1.7(P7) J1.8(P8) J1.S(SHLD) R48.1 R49.2 R51.2 R80.2 Y1.2(GND) Y1.4(GND)
CRS: IC19.11(CRS_DV/~{MODE2}) R43.1 ; off-sheet CRS
ENET_CRS: R43.2 ; off-sheet ENET_CRS, port ENET.CRS
ENET_MDC: IC19.13(MDC) ; off-sheet ENET_MDC, port ENET.ENET_MDC
ENET_MDIO: IC19.12(MDIO) R42.2 ; off-sheet ENET_MDIO, port ENET.ENET_MDIO
ENET_REFCLK: IC18.2(A) ; off-sheet ENET_REFCLK, port ENET.ENET_REFCLK
ENET_RX_ER: IC19.10(RXER/~{PHYAD0}) R39.1 ; off-sheet ENET_RX_ER, port ENET.ENET_RX_ER
ENET_RXD0: R40.2 ; off-sheet ENET_RXD0, port ENET.RXD0
ENET_RXD1: R41.2 ; off-sheet ENET_RXD1, port ENET.RXD1
ENET_TX_EN: IC19.16(TXEN) ; off-sheet ENET_TX_EN, port ENET.ENET_TX_EN
ENET_TXD0: IC19.17(TXD0) ; off-sheet ENET_TXD0, port ENET.ENET_TXD0
ENET_TXD1: IC19.18(TXD1) ; off-sheet ENET_TXD1, port ENET.ENET_TXD1
REFCLK: IC18.4(Y) IC19.14(~{INT}/REFCLK0) ; off-sheet REFCLK
RSTOUT: IC19.15(~{RST}) ; off-sheet RSTOUT, port ENET.RSTOUT
RX_N: C38.2 IC19.22(RXN) J1.1(P1) R44.1
RX_P: C39.2 IC19.23(RXP) J1.3(P3) R45.1
RXD0: IC19.8(RXD0/~{MODE0}) R40.1 ; off-sheet RXD0
RXD1: IC19.7(RXD1/~{MODE1}) R41.1 ; off-sheet RXD1
TX_N: C40.2 IC19.20(TXN) J1.4(P4) R46.1
TX_P: C41.2 IC19.21(TXP) J1.6(P6) R47.1
NetC42_1: C42.1 IC19.5(XTAL1/CLKIN) R81.2 Y1.1
NetC43_1: C43.1 IC19.4(XTAL2) R81.1 Y1.3
NetIC19_2: IC19.2(LED2~{/INTSEL}) J1.9(P9) R49.1
NetIC19_3: IC19.3(LED1/~{REGOFF}) J1.11(P11)
NetIC19_24: IC19.24(RBIAS) R48.2
NetJ1_10: J1.10(P10) R80.1
NetJ1_12: J1.12(P12) R51.1

### Layout directives
differential pair: RX_N, RX_P, TX_N, TX_P

### Notes on the sheet
- ETHERNET
- Title
- Size:
- Date:
- B
- Number:
- Time:
- Revision:
- Sheet
- of
- File:
- (in symbol ARJC02-111008B) YEL; GRN

### Library data of the parts
C38-C41 = VJ0402A180JXJPW1BC: CAP CER 18PF 16V C0G/NP0 0402; Manufacturer: Vishay Vitramon; Temperature Coefficient: C0G, NP0; Tolerance: ±5%; Part Number: VJ0402A180JXJPW1BC; Value: 18pF; Applications: General Purpose; Capacitance: 18pF; ComponentLink1Description: Datasheet; ComponentLink1URL: https://www.vishay.com/docs/28548/vjw1bcbascomseries.pdf; ComponentLink2Description: DigiKey Link; ComponentLink2URL: http://digikey.com/product-detail/en/vishay-vitramon/VJ0402A180JXJPW1BC/720-1639-1-ND/8324059; Device Package: 0402 (1005 Metric); LastUpdated: 9/2/2020 01:02:23; Lifecycle Status: Active; Minimum Order: 1; Mounting Type: Surface Mount, MLCC; Operating Temperature: -55°C ~ 125°C; Package / Case: 0402 (1005 Metric); Packaging: TapeAndReel; PartId: 2399; Part Status: Active; Price: 0.01; Series: VJ; Size / Dimension: 0.039" L x 0.020" W (1.00mm x 0.50mm); Supplier 1: DigiKey; Supplier Part Number 1: 720-1639-1-ND; Thickness (Max): 0.022" (0.55mm); Voltage - Rated: 16V
C42 C43 = C0402C120J8GAC7867: CAP CER 12PF 10V NP0 0402; Manufacturer: KEMET; Temperature Coefficient: C0G, NP0; Tolerance: ±5%; Part Number: C0402C120J8GAC7867; Value: 12pF; Applications: General Purpose; Capacitance: 12pF; ComponentLink1Description: Datasheet; ComponentLink1URL: https://api.kemet.com/component-edge/download/datasheet/C0402C120J8GACTU.pdf; ComponentLink2Description: DigiKey Link; ComponentLink2URL: http://digikey.com/product-detail/en/kemet/C0402C120J8GAC7867/399-14417-1-ND/7103709; Device Package: 0402 (1005 Metric); Features: Low ESL; LastUpdated: 9/2/2020 01:02:11; Lifecycle Status: Active; Minimum Order: 1; Mounting Type: Surface Mount, MLCC; Operating Temperature: -55°C ~ 125°C; Package / Case: 0402 (1005 Metric); Packaging: TapeAndReel; PartId: 7556; Part Status: Active; Price: 0.07; Series: SMD Comm C0G; Size / Dimension: 0.039" L x 0.020" W (1.00mm x 0.50mm); Supplier 1: DigiKey; Supplier Part Number 1: 399-14417-1-ND; Thickness (Max): 0.022" (0.55mm); Voltage - Rated: 10V
C44 C45 C47 C48 = CC0402MRX5R5BB104: CAP CER 0.1UF 6.3V X5R 0402; Manufacturer: Yageo; Tolerance: ±20%; Part Number: CC0402MRX5R5BB104; Value: 0.1µF; Applications: General Purpose; Capacitance: 0.1µF; ComponentLink1Description: Datasheet; ComponentLink1URL: https://www.yageo.com/upload/media/product/productsearch/datasheet/mlcc/UPY-GPHC_X5R_4V-to-50V_25.pdf; ComponentLink2Description: DigiKey Link; ComponentLink2URL: http://digikey.com/product-detail/en/yageo/CC0402MRX5R5BB104/311-3818-1-ND/8024907; Device Package: 0402 (1005 Metric); LastUpdated: 9/2/2020 01:02:24; Lifecycle Status: Active; Minimum Order: 1; Mounting Type: Surface Mount, MLCC; Operating Temperature: -55°C ~ 85°C; Package / Case: 0402 (1005 Metric); Packaging: CutTape; PartId: 1960; Part Status: Active; Price: 0.10; Series: CC; Size / Dimension: 0.039" L x 0.020" W (1.00mm x 0.50mm); Supplier 1: DigiKey; Supplier Part Number 1: 311-3818-1-ND; Temperature Coefficient: X5R; Thickness (Max): 0.022" (0.55mm); Voltage - Rated: 6.3V
C46 C49 = UMK107ABJ105MAHT: CAP CER 1UF 50V X5R 0603; Manufacturer: Taiyo Yuden; Tolerance: ±20%; Part Number: UMK107ABJ105MAHT; Value: 1µF; Applications: Automotive, SMPS Filtering; Capacitance: 1µF; ComponentLink1Description: Datasheet; ComponentLink1URL: https://www.yuden.co.jp/productdata/catalog/mlcc_all_hq_e.pdf; ComponentLink2Description: DigiKey Link; ComponentLink2URL: http://digikey.com/product-detail/en/taiyo-yuden/UMK107ABJ105MAHT/587-4958-1-ND/6563801; Device Package: 0603 (1608 Metric); LastUpdated: 9/2/2020 01:03:34; Lifecycle Status: Active; Minimum Order: 1; Mounting Type: Surface Mount, MLCC; Operating Temperature: -55°C ~ 85°C; Package / Case: 0603 (1608 Metric); Packaging: TapeAndReel; PartId: 3194; Part Status: Active; Price: 0.04; Ratings: AEC-Q200; Series: M; Size / Dimension: 0.063" L x 0.031" W (1.60mm x 0.80mm); Supplier 1: DigiKey; Supplier Part Number 1: 587-4958-1-ND; Temperature Coefficient: X5R; Thickness (Max): 0.037" (0.95mm); Voltage - Rated: 50V
C50 = GRM188R60J106KE47D: as C55 on sheet smoothieboard-alt-p4; Part Number: GRM188R60J106KE47D; Value: 10µF; Applications: General Purpose; Capacitance: 10µF; ComponentLink1Description: Datasheet; ComponentLink1URL: https://search.murata.co.jp/Ceramy/image/img/A01X/G101/ENG/GRM188R60J106KE47-02.pdf; ComponentLink2Description: DigiKey Link; ComponentLink2URL: http://digikey.com/product-detail/en/murata-electronics/GRM188R60J106KE47D/490-12538-1-ND/5797528; Device Package: 0603 (1608 Metric); LastUpdated: 9/2/2020 01:03:11; Lifecycle Status: Active; Minimum Order: 1; Mounting Type: Surface Mount, MLCC; Operating Temperature: -55°C ~ 85°C; Package / Case: 0603 (1608 Metric); Packaging: TapeAndReel; PartId: 14982; Part Status: Active; Price: 0.03; Series: GRM; Size / Dimension: 0.063" L x 0.031" W (1.60mm x 0.80mm); Supplier 1: DigiKey; Supplier Part Number 1: 490-12538-1-ND; Temperature Coefficient: X5R; Thickness (Max): 0.035" (0.90mm); Voltage - Rated: 6.3V
FB1 = LF1206E152R-10: FERRITE BEAD 946 OHM 1206 1LN; Manufacturer: Laird-Signal Integrity Products; Current Rating (Max): 500mA; DC Resistance (DCR) (Max): 300mOhm; Filter Type: Power, Signal Line; Number of Lines: 1; Part Number: LF1206E152R-10; ComponentLink1Description: Datasheet; ComponentLink1URL: https://assets.lairdtech.com/home/brandworld/files/Catalog_EMI%20FILTERING%20RF%200717.pdf; ComponentLink2Description: DigiKey Link; ComponentLink2URL: http://digikey.com/product-detail/en/laird-signal-integrity-products/LF1206E152R-10/240-2566-1-ND/1236446; Device Package: 1206 (3216 Metric); Height (Max): 0.051" (1.30mm); Impedance @ Frequency: 946 Ohms @ 100MHz; LastUpdated: 9/2/2020 01:18:24; Lifecycle Status: Active; Minimum Order: 1; Mounting Type: Surface Mount; Operating Temperature: -40°C ~ 125°C; Package / Case: 1206 (3216 Metric); Packaging: TapeAndReel; PartId: 1683; Part Status: Active; Price: 0.05; Series: LF; Size / Dimension: 0.126" L x 0.063" W (3.20mm x 1.60mm); Supplier 1: DigiKey; Supplier Part Number 1: 240-2566-1-ND; Value: 946 Ohms @ 100MHz
IC18 = 74AHC1G14SE-7: IC INVERTER SCHMITT 1CH SOT353; Manufacturer: Diodes Incorporated; Current - Output High, Low: 8mA, 8mA; Current - Quiescent (Max): 1µA; Logic Level - High: 2.2V ~ 3.85V; Logic Level - Low: 0.9V ~ 1.65V; Max Propagation Delay @ V, Max CL: 10.6ns @ 5V, 50pF; Number of Circuits: 1; Voltage - Supply: 2V ~ 5.5V; Part Number: 74AHC1G14SE-7; ComponentLink1Description: Datasheet; ComponentLink1URL: https://www.diodes.com/assets/Datasheets/74AHC1G14.pdf; ComponentLink2Description: DigiKey Link; ComponentLink2URL: http://digikey.com/product-detail/en/diodes-incorporated/74AHC1G14SE-7/74AHC1G14SE-7DICT-ND/2639309; Device Package: 5-TSSOP, SC-70-5, SOT-353; Features: Schmitt Trigger; LastUpdated: 3/4/2020 22:03:22; Lifecycle Status: Active; Logic Type: Inverter; Minimum Order: 1; Mounting Type: Surface Mount; Number of Inputs: 1; Operating Temperature: -40°C ~ 125°C; Package / Case: 5-TSSOP, SC-70-5, SOT-353; Packaging: TapeAndReel; PartId: 8; Part Status: Active; Price: 0.05; Series: 74AHC; Supplier 1: DigiKey; Supplier Part Number 1: 74AHC1G14SE-7DICT-ND; Supplier Device Package: SOT-353
IC19 = LAN8720AI-CP: IC TRANSCEIVER FULL 2/2 24QFN; Manufacturer: Microchip Technology; Protocol: RMII; Voltage - Supply: 1.6V ~ 3.6V; Part Number: LAN8720AI-CP; ComponentLink1Description: Datasheet; ComponentLink1URL: http://www.microchip.com/mymicrochip/filehandler.aspx?ddocname=en586588; ComponentLink2Description: DigiKey Link; ComponentLink2URL: http://digikey.com/product-detail/en/microchip-technology/LAN8720AI-CP/638-1084-ND/2166036; Duplex: Full; LastUpdated: 9/2/2020 01:27:36; Lifecycle Status: Active; Minimum Order: 1; Mounting Type: Surface Mount; Number of Drivers/Receivers: 2/2; Operating Temperature: -40°C ~ 85°C; Package / Case: 24-VFQFN Exposed Pad; Packaging: Tray; Part Status: Active; Price: 1.45; Series: -; Supplier 1: DigiKey; Supplier Part Number 1: 638-1084-ND; Supplier Device Package: 24-QFN-EP (4x4); Type: Transceiver
J1 = ARJC02-111008B: CONN MAGJACK 1PORT 100 BASE-TX; Manufacturer: Abracon LLC; Connector Type: RJ45; LED Color: Yellow - Green; Number of Cores per Jack: 4; Number of Ports: 1; Shielding: Shielded, EMI Finger; Tab Direction: Down; Part Number: ARJC02-111008B; Applications: 10/100 Base-TX, AutoMDIX; ComponentLink1Description: Datasheet; ComponentLink1URL: https://abracon.com/Magnetics/lan/ARJC02-111008B.PDF; ComponentLink2Description: DigiKey Link; ComponentLink2URL: http://digikey.com/product-detail/en/abracon-llc/ARJC02-111008B/535-12605-ND/4696789; Features: Board Guide; Height Above Board: 0.534" (13.55mm); LastUpdated: 1/15/2020 03:56:28; Lifecycle Status: Active; Minimum Order: 1; Mounting Type: Through Hole; Number of Rows: 1; Operating Temperature: 0°C ~ 70°C; Orientation: 90° Angle (Right); Packaging: Tray; Part Status: Active; Price: 7.80; Series: ARJC02; Supplier 1: DigiKey; Supplier Part Number 1: 535-12605-ND; Termination: Solder
R39 R49 = RCS060310K0JNEA: RES SMD 10K OHM 5% 1/4W 0603; Manufacturer: Vishay Dale; Power (Watts): 0.25W, 1/4W; Temperature Coefficient: ±200ppm/°C; Part Number: RCS060310K0JNEA; Value: 10 kOhms; ComponentLink1Description: Datasheet; ComponentLink1URL: http://www.vishay.com/docs/20065/rcse3.pdf; ComponentLink2Description: DigiKey Link; ComponentLink2URL: http://digikey.com/product-detail/en/vishay-dale/RCS060310K0JNEA/541-2817-1-ND/5867110; Composition: Thick Film; Device Package: 0603 (1608 Metric); Features: Automotive AEC-Q200, Pulse Withstanding; Height - Seated (Max): 0.020" (0.50mm); LastUpdated: 9/2/2020 01:10:24; Lifecycle Status: Active; Minimum Order: 1; Number of Terminations: 2; Operating Temperature: -55°C ~ 155°C; Package / Case: 0603 (1608 Metric); Packaging: TapeAndReel; PartId: 5383; Part Status: Active; Price: 0.02; Ratings: AEC-Q200; Resistance: 10 kOhms; Series: RCS e3; Size / Dimension: 0.061" L x 0.033" W (1.55mm x 0.85mm); Supplier 1: DigiKey; Supplier Part Number 1: 541-2817-1-ND; Supplier Device Package: 0603; Tolerance: ±5%
R40 R41 R43 = ERJ-3EKF22R0V: RES SMD 22 OHM 1% 1/10W 0603; Manufacturer: Panasonic Electronic Components; Power (Watts): 0.1W, 1/10W; Temperature Coefficient: ±100ppm/°C; Part Number: ERJ-3EKF22R0V; Value: 22 Ohms; ComponentLink1Description: Datasheet; ComponentLink1URL: https://industrial.panasonic.com/cdbs/www-data/pdf/RDA0000/AOA0000C304.pdf; ComponentLink2Description: DigiKey Link; ComponentLink2URL: http://digikey.com/product-detail/en/panasonic-electronic-components/ERJ-3EKF22R0V/P22.0HCT-ND/1746745; Composition: Thick Film; Device Package: 0603 (1608 Metric); Features: Automotive AEC-Q200; Height - Seated (Max): 0.022" (0.55mm); LastUpdated: 9/2/2020 01:10:23; Lifecycle Status: Active; Minimum Order: 1; Number of Terminations: 2; Operating Temperature: -55°C ~ 155°C; Package / Case: 0603 (1608 Metric); Packaging: TapeAndReel; PartId: 5655; Part Status: Active; Price: 0.01; Ratings: AEC-Q200; Resistance: 22 Ohms; Series: ERJ; Size / Dimension: 0.063" L x 0.031" W (1.60mm x 0.80mm); Supplier 1: DigiKey; Supplier Part Number 1: P22.0HCT-ND; Supplier Device Package: 0603; Tolerance: ±1%
R42 = RCS04021K50FKED: RES SMD 1.5K OHM 1% 1/5W 0402; Manufacturer: Vishay Dale; Power (Watts): 0.2W, 1/5W; Temperature Coefficient: ±100ppm/°C; Part Number: RCS04021K50FKED; Value: 1.5 kOhms; ComponentLink1Description: Datasheet; ComponentLink1URL: http://www.vishay.com/docs/20065/rcse3.pdf; ComponentLink2Description: DigiKey Link; ComponentLink2URL: http://digikey.com/product-detail/en/vishay-dale/RCS04021K50FKED/541-2889-1-ND/5867182; Composition: Thick Film; Device Package: 0402 (1005 Metric); Features: Automotive AEC-Q200, Pulse Withstanding; Height - Seated (Max): 0.016" (0.40mm); LastUpdated: 9/2/2020 01:07:26; Lifecycle Status: Active; Minimum Order: 1; Number of Terminations: 2; Operating Temperature: -55°C ~ 155°C; Package / Case: 0402 (1005 Metric); Packaging: TapeAndReel; PartId: 21427; Part Status: Active; Price: 0.01; Ratings: AEC-Q200; Resistance: 1.5 kOhms; Series: RCS e3; Size / Dimension: 0.039" L x 0.020" W (1.00mm x 0.50mm); Supplier 1: DigiKey; Supplier Part Number 1: 541-2889-1-ND; Supplier Device Package: 0402; Tolerance: ±1%
R44-R47 = RR0510R-49R9-D: RES SMD 49.9 OHM 0.5% 1/16W 0402; Manufacturer: Susumu; Power (Watts): 0.063W, 1/16W; Temperature Coefficient: ±100ppm/°C; Part Number: RR0510R-49R9-D; Value: 49.9 Ohms; ComponentLink1Description: Datasheet; ComponentLink1URL: http://www.susumu.co.jp/common/pdf/n_catalog_partition05_en.pdf; ComponentLink2Description: DigiKey Link; ComponentLink2URL: http://digikey.com/product-detail/en/susumu/RR0510R-49R9-D/RR05R49.9DCT-ND/567334; Composition: Thin Film; Device Package: 0402 (1005 Metric); Height - Seated (Max): 0.016" (0.40mm); LastUpdated: 9/2/2020 01:08:09; Lifecycle Status: Active; Minimum Order: 1; Number of Terminations: 2; Operating Temperature: -55°C ~ 125°C; Package / Case: 0402 (1005 Metric); Packaging: TapeAndReel; PartId: 3128; Part Status: Active; Price: 0.01; Resistance: 49.9 Ohms; Series: RR; Size / Dimension: 0.039" L x 0.020" W (1.00mm x 0.50mm); Supplier 1: DigiKey; Supplier Part Number 1: RR05R49.9DCT-ND; Tolerance: ±0.5%
R48 = CRCW040212K1FKTD: RES SMD 12.1K OHM 1% 1/16W 0402; Manufacturer: Vishay Dale; Power (Watts): 0.063W, 1/16W; Temperature Coefficient: ±100ppm/°C; Part Number: CRCW040212K1FKTD; Value: 12.1 kOhms; ComponentLink1Description: Datasheet; ComponentLink1URL: http://www.vishay.com/docs/20008/dcrcw.pdf; ComponentLink2Description: DigiKey Link; ComponentLink2URL: http://digikey.com/product-detail/en/vishay-dale/CRCW040212K1FKTD/541-CRCW040212K1FKTDCT-ND/11500769; Composition: Thick Film; Device Package: 0402 (1005 Metric); Features: Automotive AEC-Q200; LastUpdated: 9/2/2020 01:07:21; Lifecycle Status: Active; Minimum Order: 1; Number of Terminations: 2; Operating Temperature: -55°C ~ 155°C; Package / Case: 0402 (1005 Metric); Packaging: TapeAndReel; PartId: 56740; Price: 0.01; Ratings: AEC-Q200; Resistance: 12.1 kOhms; Series: CRCW; Supplier 1: DigiKey; Supplier Part Number 1: 541-CRCW040212K1FKTDCT-ND; Supplier Device Package: 0402; Tolerance: ±1%
R51 R80 = ERJ-3GEYJ331V: RES SMD 330 OHM 5% 1/10W 0603; Manufacturer: Panasonic Electronic Components; Power (Watts): 0.1W, 1/10W; Temperature Coefficient: ±200ppm/°C; Part Number: ERJ-3GEYJ331V; Value: 330 Ohms; ComponentLink1Description: Datasheet; ComponentLink1URL: http://industrial.panasonic.com/www-cgi/jvcr13pz.cgi?E+PZ+3+AOA0001+ERJ3GEYJ331V+7+WW; ComponentLink2Description: DigiKey Link; ComponentLink2URL: http://digikey.com/product-detail/en/panasonic-electronic-components/ERJ-3GEYJ331V/P330GCT-ND/134778; Composition: Thick Film; Device Package: 0603 (1608 Metric); Features: Automotive AEC-Q200; Height - Seated (Max): 0.022" (0.55mm); LastUpdated: 9/2/2020 01:10:18; Lifecycle Status: Active; Minimum Order: 1; Number of Terminations: 2; Operating Temperature: -55°C ~ 155°C; Package / Case: 0603 (1608 Metric); Packaging: TapeAndReel; PartId: 8114; Part Status: Active; Price: 0.01; Ratings: AEC-Q200; Resistance: 330 Ohms; Series: ERJ; Size / Dimension: 0.063" L x 0.031" W (1.60mm x 0.80mm); Supplier 1: DigiKey; Supplier Part Number 1: P330GCT-ND; Supplier Device Package: 0603; Tolerance: ±5%
R81 = RCS04021M00FKED: RES SMD 1M OHM 1% 1/5W 0402; Manufacturer: Vishay Dale; Power (Watts): 0.2W, 1/5W; Temperature Coefficient: ±100ppm/°C; Part Number: RCS04021M00FKED; Value: 1 MOhms; ComponentLink1Description: Datasheet; ComponentLink1URL: http://www.vishay.com/docs/20065/rcse3.pdf; ComponentLink2Description: DigiKey Link; ComponentLink2URL: http://digikey.com/product-detail/en/vishay-dale/RCS04021M00FKED/541-2902-1-ND/5867195; Composition: Thick Film; Device Package: 0402 (1005 Metric); Features: Automotive AEC-Q200, Pulse Withstanding; Height - Seated (Max): 0.016" (0.40mm); LastUpdated: 9/2/2020 01:07:29; Lifecycle Status: Active; Minimum Order: 1; Number of Terminations: 2; Operating Temperature: -55°C ~ 155°C; Package / Case: 0402 (1005 Metric); Packaging: TapeAndReel; PartId: 20245; Part Status: Active; Price: 0.01; Ratings: AEC-Q200; Resistance: 1 MOhms; Series: RCS e3; Size / Dimension: 0.039" L x 0.020" W (1.00mm x 0.50mm); Supplier 1: DigiKey; Supplier Part Number 1: 541-2902-1-ND; Supplier Device Package: 0402; Tolerance: ±1%
Y1 = CX2016DB25000H0FLJC1: CRYSTAL 25.0000MHZ 12PF SMD; Manufacturer: Kyocera International Inc. Electronic Components; ESR (Equivalent Series Resistance): 150 Ohms; Frequency Stability: ±15ppm; Frequency Tolerance: ±10ppm; Operating Mode: Fundamental; Part Number: CX2016DB25000H0FLJC1; ComponentLink1Description: Datasheet; ComponentLink1URL: //media.digikey.com/pdf/Data%20Sheets/AVX%20PDFs/CX2016DB_USY1M-H1-16426-00_Spec.pdf; ComponentLink2Description: DigiKey Link; ComponentLink2URL: http://digikey.com/product-detail/en/kyocera-international-inc-electronic-components/CX2016DB25000H0FLJC1/1253-1709-1-ND/6123336; Frequency: 25MHz; Height - Seated (Max): 0.018" (0.45mm); LastUpdated: 9/2/2020 01:21:56; Lifecycle Status: Active; Load Capacitance: 12pF; Minimum Order: 1; Mounting Type: Surface Mount; Operating Temperature: -30°C ~ 85°C; Package / Case: 4-SMD, No Lead; Packaging: TapeAndReel; PartId: 458; Part Status: Active; Price: 0.36; Series: CX2016DB, Kyocera; Size / Dimension: 0.079" L x 0.063" W (2.00mm x 1.60mm); Supplier 1: DigiKey; Supplier Part Number 1: 1253-1709-1-ND; Type: MHz Crystal; Value: 25MHz